# EAGLE design muralizer_3_1_motorboard (EAGLE 5.10)
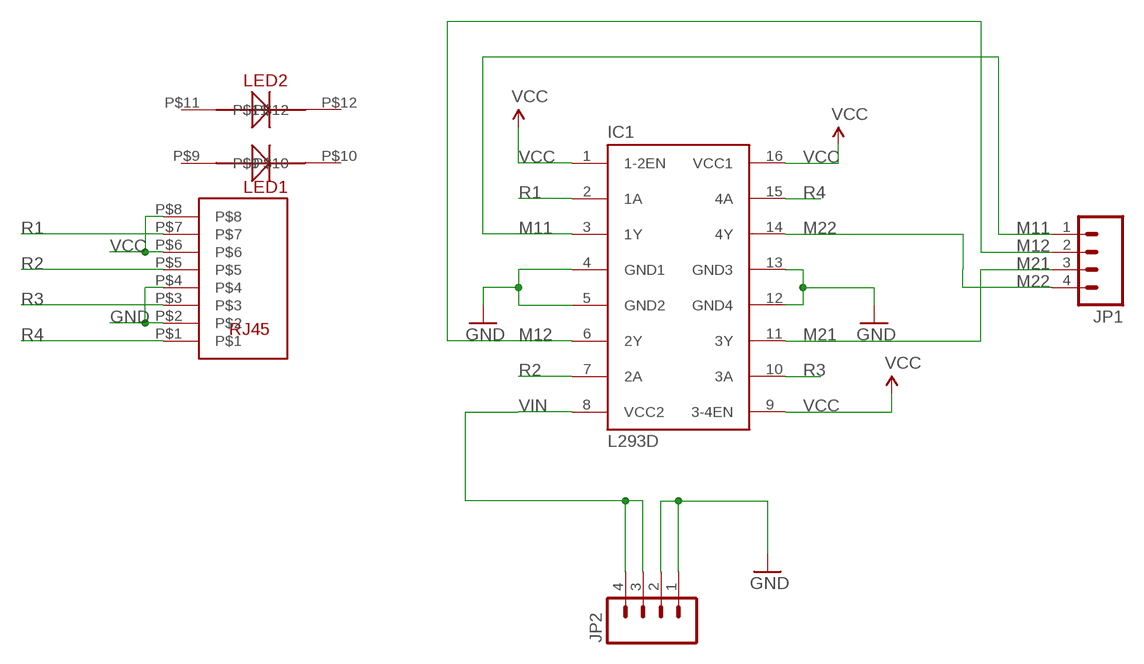
[diagram p0: schematic, sheet 1]

## Parts
IC1  L293D  [DIL16]
JP1  M04SCREW  [SCREWTERMINAL-3.5MM-4]
JP2  M04SCREW  [SCREWTERMINAL-3.5MM-4]
U$8  RJ45-LEDSAMP-RJHS-UNSHIELDED  [RJ45-AMP-RJHS]

## Nets
GND: IC1.4(GND1) IC1.5(GND2) IC1.12(GND4) IC1.13(GND3) JP2.1 JP2.2 U$8.P$2 U$8.P$4
M11: IC1.3(1Y) JP1.1
M12: IC1.6(2Y) JP1.2
M21: IC1.11(3Y) JP1.3
M22: IC1.14(4Y) JP1.4
R1: IC1.2(1A) U$8.P$7
R2: IC1.7(2A) U$8.P$5
R3: IC1.10(3A) U$8.P$3
R4: IC1.15(4A) U$8.P$1
VCC: IC1.1(1-2EN) IC1.9(3-4EN) IC1.16(VCC1) U$8.P$6 U$8.P$8
VIN: IC1.8(VCC2) JP2.3 JP2.4
Unconnected: U$8.P$9 U$8.P$10 U$8.P$11 U$8.P$12

## Library data of the parts
IC1 = st-microelectronics:L293D: PUSH-PULL 4 CHANNEL DRIVER
JP1 JP2 = AppliedPlatonics:M04: Header 4 Standard 4-pin 0.1" header. Use with straight break away headers (SKU : PRT-00116), right angle break away headers (PRT-00553), swiss pins (PRT-00743), machine pins (PRT-00117), and female headers (PRT-00115). Molex polarized connector foot print use with SKU : PRT-08231 with associated crimp pins and housings.
U$8 = AppliedPlatonics:RJ45-LEDS

## Board
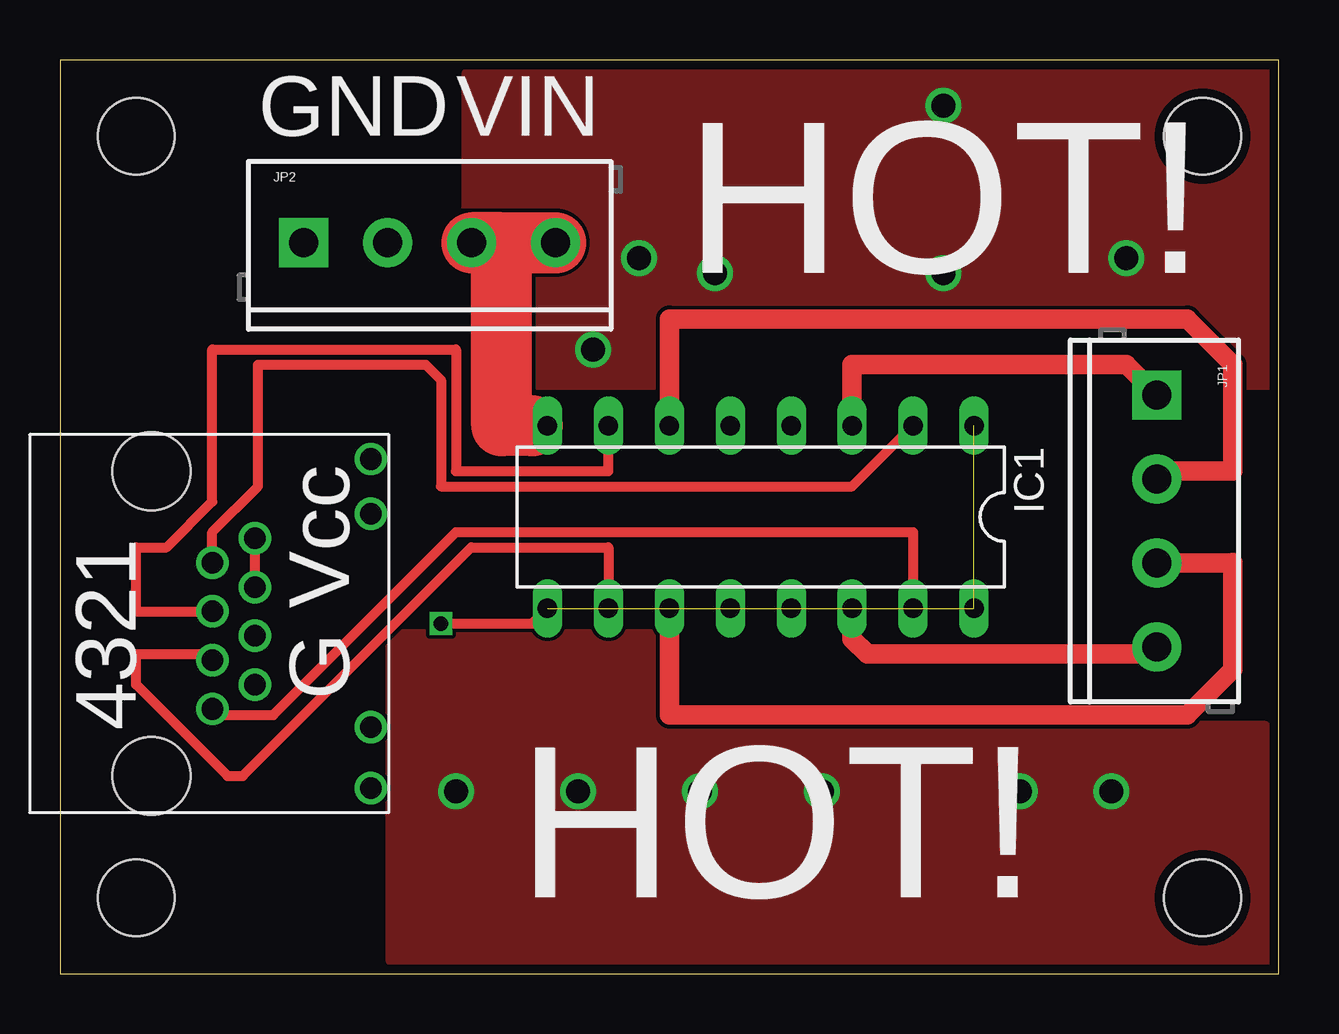
[diagram p1: board, top side]
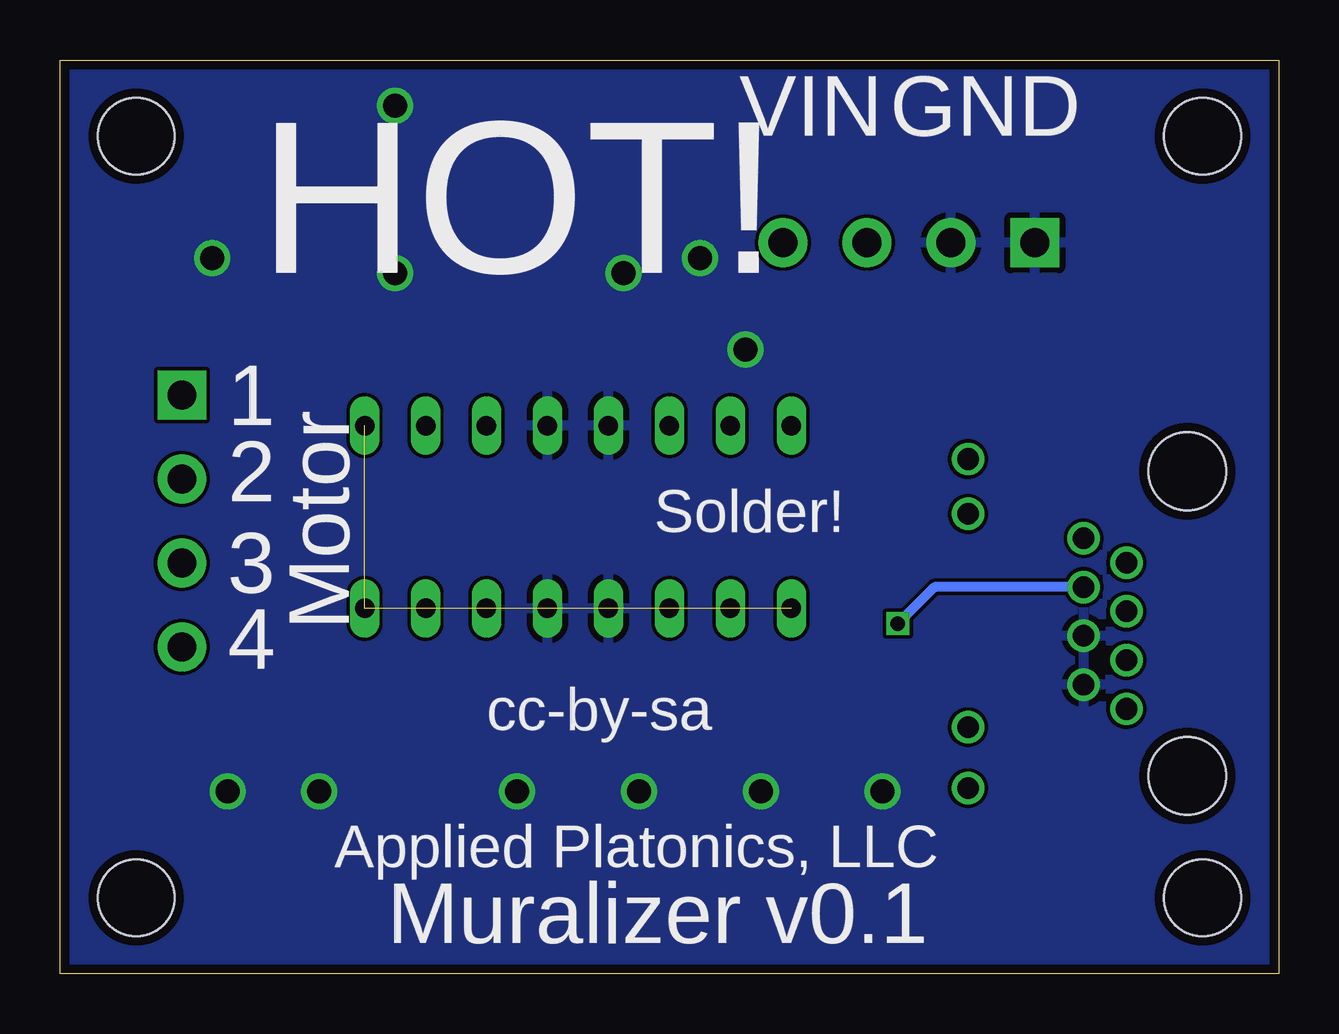
[diagram p2: board, bottom side, seen from below]

Size 50.8 x 38.1 mm. Coordinates in mm from the lower left corner, seen from the top.
Outline: 0,0 50.8,0 50.8,38.1 0,38.1 0,0
Copper layers (1*16): Top 0.0356mm / dielectric 1.5011mm / Bottom 0.0356mm
Design rules "LaenPCBOrder": minimum track width 6mil, minimum drill 13mil, track to track 6mil, track to pad 6mil, pad to pad 6mil, via to via 6mil, smd to smd 6mil, copper to edge 15mil, drill to drill 6mil, minimum pad ring 7mil, minimum via ring 7mil, stop-mask expansion 4mil, vias tented up to drill 0mil, thermal gap 10mil
Holes 3.2 mm at 3.17,34.92 47.62,34.92 47.62,3.17 3.17,3.17

### Footprints (pad centres in the part's own frame; a part is rotated, then mirrored left to right if it is on the bottom)
DIL16 = drill 0.813 long: 1 -8.89,-3.81; 2 -6.35,-3.81; 3 -3.81,-3.81; 4 -1.27,-3.81; 5 1.27,-3.81; 6 3.81,-3.81; 7 6.35,-3.81; 8 8.89,-3.81; 9 8.89,3.81; 10 6.35,3.81; 11 3.81,3.81; 12 1.27,3.81; 13 -1.27,3.81; 14 -3.81,3.81; 15 -6.35,3.81; 16 -8.89,3.81
SCREWTERMINAL-3.5MM-4 = drill 1.2 pad 2.032 square: 1 0,0 | drill 1.2 pad 2.032 round: 2 3.5,0; 3 7,0; 4 10.5,0
RJ45-AMP-RJHS = drill 0.9 round: P$1 3.556,2.54; P$2 2.54,4.318; P$3 1.524,2.54; P$4 0.508,4.318; P$5 -0.508,2.54; P$6 -1.524,4.318; P$7 -2.54,2.54; P$8 -3.556,4.318; P$9 6.858,9.144; P$10 4.318,9.144; P$11 -4.572,9.144; P$12 -6.858,9.144 | hole 3.251: -6.35,0; 6.35,0

### Placement (x,y rotation side)
IC1  29.21,19.05 180 top
JP1  45.72,24.13 270 top
JP2  10.16,30.48 0 top
U$8  3.81,14.61 270 top

### Tracks (layer width: path | path; a pad name or v marks a point on that pad's centre or on a via)
GND  (via drill 1)
  other vias: 27.3,29.21 22.23,26.04 36.83,29.21 44.45,29.84 16.51,7.62 21.59,7.62 26.67,7.62 43.81,7.62 40.01,7.62 31.75,7.62 36.83,36.2 24.13,29.84
  pour Bottom: 0,39.37 59.69,39.37 59.69,0 0,0
  pour Top: 17.14,24.77 17.14,37.47 50.8,37.47 50.8,24.77
  pour Top: 13.97,13.97 13.97,0.64 50.16,0.64 50.16,10.16 49.53,10.16 25.4,10.16 25.4,13.97 24.13,13.97
M11
  Top 0.813: IC1.3 33.02,25.4 44.45,25.4 JP1.1
M12
  Top 0.813: IC1.6 25.4,27.3 46.99,27.3 48.9,25.4 48.9,20.95 46.05,20.95 JP1.2
M21
  Top 0.813: JP1.3 48.88,17.13 48.9,17.14 48.9,12.7 46.99,10.79 25.4,10.79 IC1.11
M22
  Top 0.813: IC1.14 33.02,13.97 33.66,13.34 45.42,13.34 JP1.4
R1
  Top 0.406: U$8.P$7 6.35,18.41 8.26,20.32 8.26,25.4 15.24,25.4 15.88,24.77 15.88,20.32 33.02,20.32 IC1.2
R2
  Top 0.406: IC1.7 22.86,20.95 16.51,20.95 16.51,26.04 6.35,26.04 6.35,19.68 4.45,17.78 3.17,17.78 3.17,15.11 U$8.P$5
R3
  Top 0.406: U$8.P$3 6.1,13.34 3.17,13.34 3.17,12.7 3.17,12.06 6.99,8.26 7.62,8.26 17.14,17.78 22.86,17.78 IC1.10
R4
  Top 0.406: U$8.P$1 6.6,10.79 8.89,10.79 16.51,18.41 35.56,18.41 IC1.15
VCC  (via drill 0.6)  (2 unrouted)
  Top 0.406: U$8.P$6 U$8.P$8 | v15.88,14.61 19.68,14.61 IC1.9
  Bottom 0.406: U$8.P$6 14.35,16.13 v15.88,14.61
VIN
  Top 1.016: 19.68,22.86 IC1.8
  Top 2.54: 18.41,30.48 JP2.3 | 18.41,30.48 JP2.4 18.41,30.48 | 18.41,30.48 18.41,22.86 19.68,22.86

### Text on the board
tPlace: GND | VIN | HOT! | Vcc | G | 4321 | HOT!
bPlace: GND | VIN | HOT! | Motor | 1 | 2 | Solder! | 3 | 4 | cc-by-sa | Muralizer v0.1 | Applied Platonics, LLC